# Altium schematic sheet USB_OTG_FS.SchDoc: USB_OTG_FS
size A4; DocumentNumber: MB1144; Revision: C-02; SheetNumber: 18; SheetTotal: 25; Project: STM32L476G-EVAL; ModifiedDate: 9/23/2015
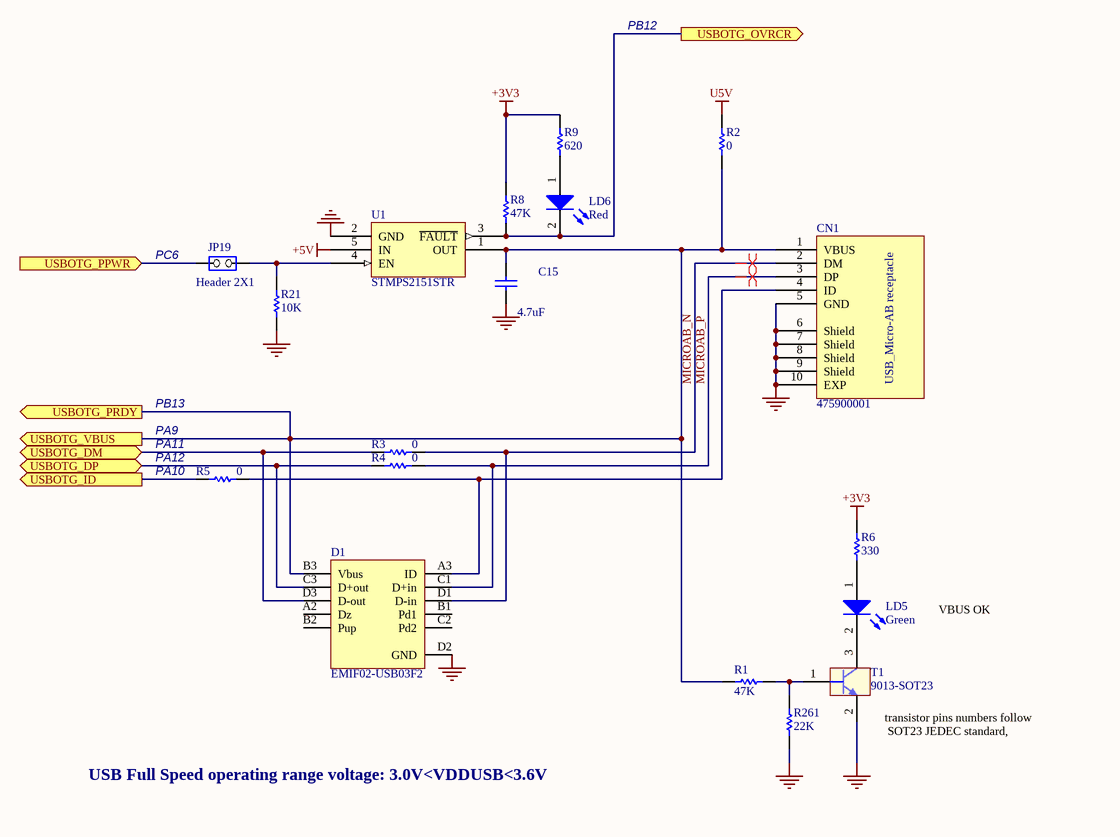
[diagram p0: USB_OTG_FS.SchDoc]

## Parts
C15  4.7uF  [0603C]
CN1  475900001  [MOLEX_47590001]
D1  EMIF02-USB03F2  [BGA11_0R5_1R57X2R07]
JP19  Header 2X1  [SIP2]
LD5  Green  [0603D]
LD6  Red  [0603D]
R1  47K  [0402R]
R2  0  [0603R]
R3  0  [0603R]
R4  0  [0603R]
R5  0  [0603R]
R6  330  [0402R]
R8  47K  [0402R]
R9  620  [0402R]
R21  10K  [0402R]
R261  22K  [0402R]
T1  9013-SOT23  [SOT-23]
U1  STMPS2151STR  [SOT23-5]

## Ports
USBOTG_DM (bidir), USBOTG_DP (bidir), USBOTG_ID (out), USBOTG_OVRCR (out), USBOTG_PPWR (in), USBOTG_PRDY (out), USBOTG_VBUS (out)

## Nets
+3V3: R6.1 R8.1 R9.1
+5V: U1.5(IN)
GND: C15.2 CN1.5(GND) CN1.6(Shield) CN1.7(Shield) CN1.8(Shield) CN1.9(Shield) CN1.10(EXP) D1.D2(GND) R21.1 R261.1 T1.2(E) U1.2(GND)
U5V: R2.1
MICROAB_N: CN1.2(DM) D1.D1(D-in) R3.1
MICROAB_P: CN1.3(DP) D1.C1(D+in) R4.1
USBOTG_DM: D1.D3(D-out) R3.2 ; port USBOTG_DM
USBOTG_DP: D1.C3(D+out) R4.2 ; port USBOTG_DP
USBOTG_ID: R5.2 ; port USBOTG_ID
USBOTG_OVRCR: LD6.2(K) R8.2 U1.3(~{FAULT}) ; port USBOTG_OVRCR
USBOTG_PPWR: JP19.1(COMMON) ; port USBOTG_PPWR
USBOTG_PRDY: C15.1 CN1.1(VBUS) D1.B3(Vbus) R1.1 R2.2 U1.1(OUT) ; port USBOTG_VBUS, port USBOTG_PRDY
NetCN1_4: CN1.4(ID) D1.A3(ID) R5.1
NetJP19_2: JP19.2(NO) R21.2 U1.4(EN)
NetLD5_1: LD5.1(A) R6.2
NetLD5_2: LD5.2(K) T1.3(C)
NetLD6_1: LD6.1(A) R9.2
NetR1_2: R1.2 R261.2 T1.1(B)

Not connected (* = marked no-connect by the designer): D1 A2(Dz) B1(Pd1) B2(Pup) C2(Pd2)

## Layout directives
differential pair: MICROAB_N, MICROAB_P

## Notes on the sheet
- PB12
- (near JP19) PC6
- PA9
- (near R5) PA11
- (near R5) PA12
- PB13
- (near R5) PA10
- VBUS OK
- (near T1) transistor pins numbers follow
  SOT23 JEDEC standard,
- USB Full Speed operating range voltage: 3.0V<VDDUSB<3.6V
- Title:
- Project:
- Size:
- Date:
- A4
- Reference:
- Sheet:
- Revision:
- of
- (in symbol 475900001) USB_Micro-AB receptacle

## Library data of the parts
C15 = CAP: Capacitor; Value: 100nF; Ordered by: Subcon; ECCN_US/EU: NA; Published: 8-Jun-2000; Revision: July-2002: Re-released for DXP Platform.; Publisher: Altium Limited
CN1 = 475900001: Ordered by: Subcon; ECCN_US/EU: NA; Comments: USB Micro AB receptacle
D1 = EMIF02-USB03F2: Ordered by: ST; ECCN_US/EU: EAR99/NEC; Ref St: 9179037; Manuf_1: ST; Manuf_Part_1: EMIF02-USB03F2
JP19 = JP2: Ordered by: Subcon; ECCN_US/EU: NA
LD5 LD6 = LED2: Typical RED, GREEN, YELLOW, AMBER GaAs LED; Ordered by: Subcon; ECCN_US/EU: NA; Published: 8-Jun-2000; Revision: July-2002: Re-released for DXP Platform.; Publisher: Altium Limited
R1 R6 R8 R9 R261 = res1: Resistor; Value: 1K; Ordered by: Subcon; ECCN_US/EU: NA; Published: 8-Jun-2000; Revision: July-2002: Re-released for DXP Platform.; Publisher: Altium Limited
R2-R5 R21 = Res1: Resistor; Value: 1K; Ordered by: Subcon; ECCN_US/EU: NA; Published: 8-Jun-2000; Revision: July-2002: Re-released for DXP Platform.; Publisher: Altium Limited
T1 = 9013-SOT23: NPN Bipolar Transistor; Manuf_1: Taitron; Manuf_Part_1: MMBT9013; Description: NPN Bipolar Transistor, SOT-23 Footprint; Ordered by: Subcon; ECCN_US/EU: EAR99/NEC; Revision: July-2002: Re-released for DXP Platform.; Order: MMBT9013
U1 = STMPS2141STR: Ordered by: ST; ECCN_US/EU: EAR99/NEC; Ref St: 9159009; Manuf_1: ST; Manuf_Part_1: STMPS2151STR